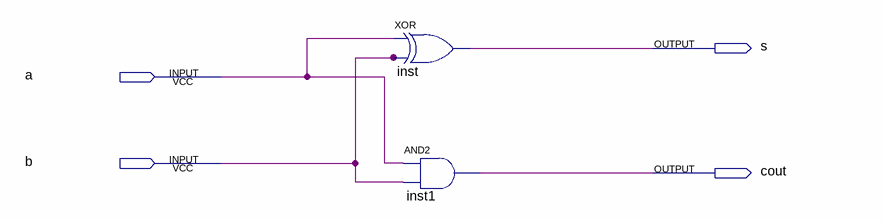
[diagram p0: schematic sheet]
// Quartus schematic halfadder.bdf as structural Verilog: 2 symbols, 4 pins
module halfadder (
  input  a,
  input  b,
  output s,
  output cout
);

  xor inst (s, a, b);
  and inst1 (cout, a, b);
endmodule
